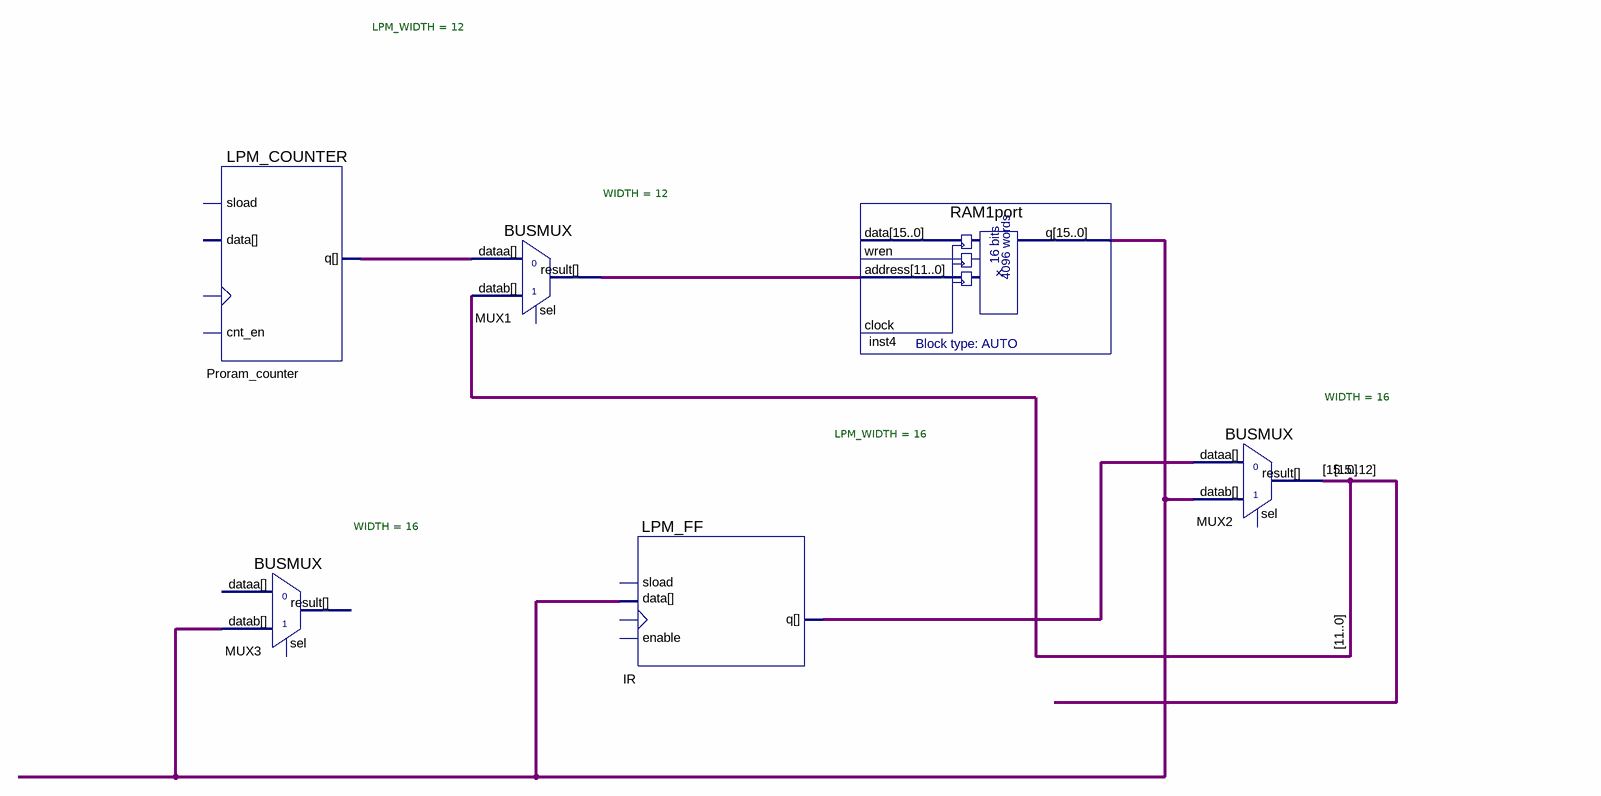
[diagram p0: schematic sheet]
// Quartus schematic CPU.bdf as structural Verilog: 6 symbols, 0 pins
module CPU (
);

  wire [11:0] MUX1_result, Proram_counter_q;
  wire [15:0] inst4_q, IR_q, MUX2_result;

  LPM_COUNTER #(.LPM_WIDTH(12)) Proram_counter (.q(Proram_counter_q));  // open: clock, cnt_en, data, sload
  BUSMUX #(.WIDTH(16)) MUX3 (.datab(inst4_q));  // open: sel, dataa, result
  BUSMUX #(.WIDTH(12)) MUX1 (.dataa(Proram_counter_q), .datab(MUX2_result), .result(MUX1_result));  // open: sel
  LPM_FF #(.LPM_WIDTH(16)) IR (.data(inst4_q), .q(IR_q));  // open: clock, enable, sload
  RAM1port inst4 (.address(MUX1_result), .q(inst4_q));  // open: clock, data, wren
  BUSMUX #(.WIDTH(16)) MUX2 (.datab(inst4_q), .dataa(IR_q), .result(MUX2_result));  // open: sel
endmodule
